# Altium schematic sheet Servo.SchDoc
size A
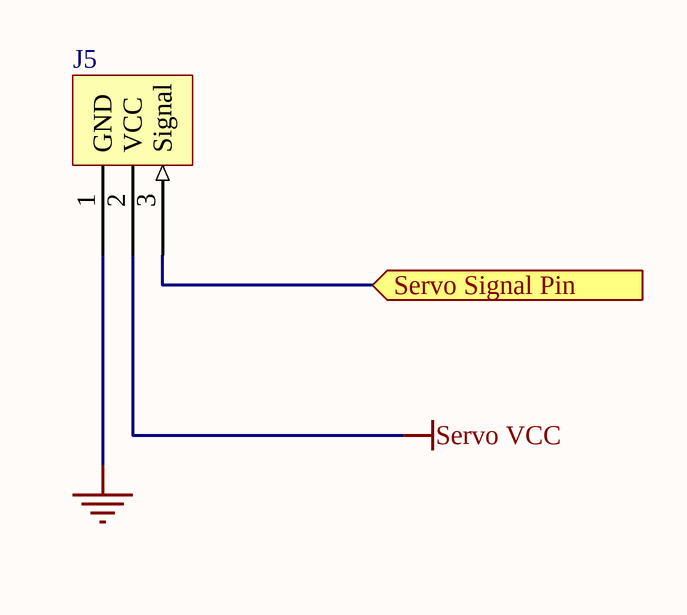
[diagram p0: Servo.SchDoc]

## Parts
J5  Servo_Connector  [SERVO CONNECTOR]  (value not drawn)

## Ports
Servo Signal Pin (in)

## Nets
GND: J5.1(GND)
Servo VCC: J5.2(VCC)
Servo Signal Pin: J5.3(Signal) ; port Servo Signal Pin

## Library data of the parts
J5 = Servo_Connector: Female Embase 3 contacts; fournisseur: Farnell; reffournisseur: 1845931; fabricant: TE CONNECTIVITY / AMP; reffabricant: 5-534237-1